# EAGLE design receiver_b (EAGLE 5.09)
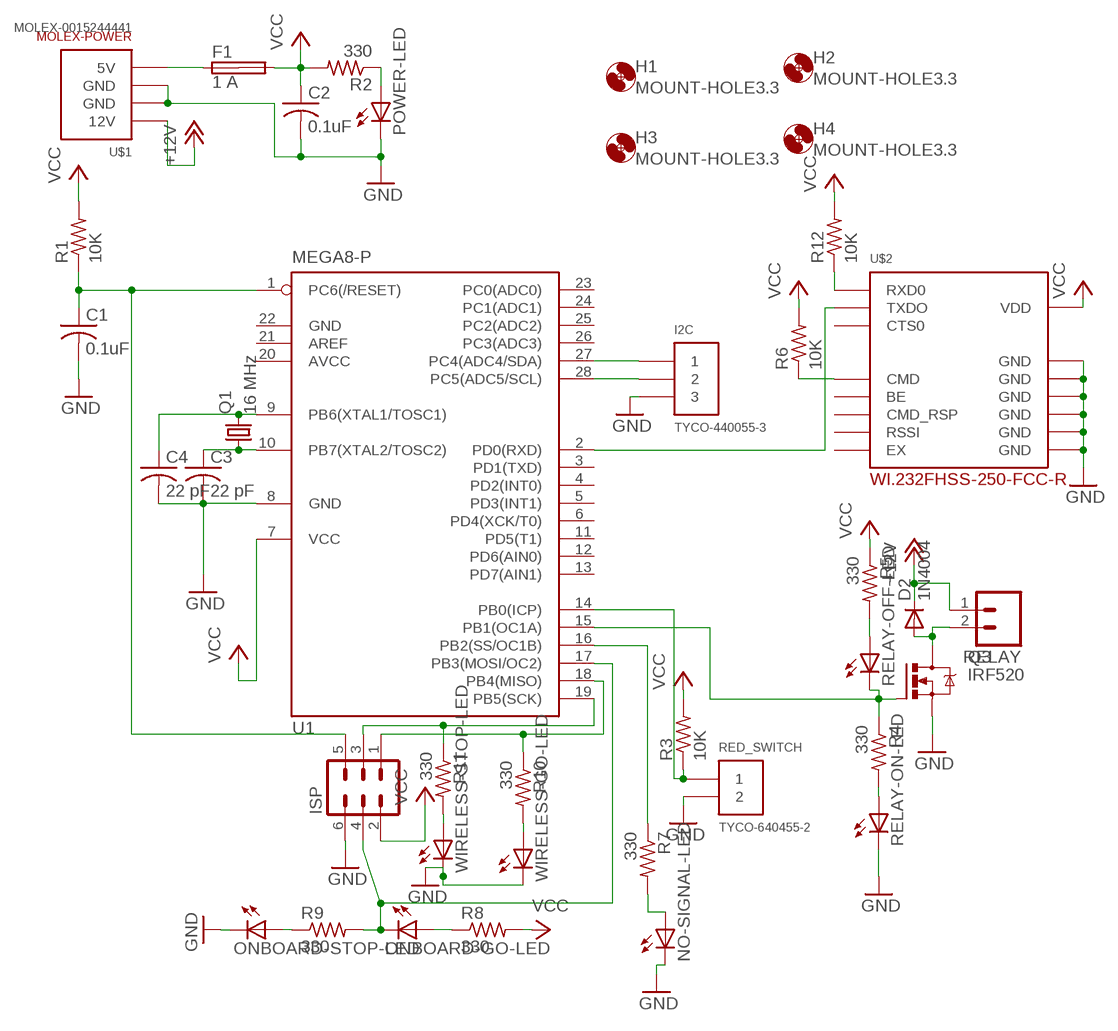
[diagram p0: schematic, sheet 1]

## Parts
C1  0.1uF  C-US050-055X075  [C050-055X075]
C2  0.1uF  C-US050-055X075  [C050-055X075]
C3  22 pF  C-US025-025X050  [C025-025X050]
C4  22 pF  C-US025-025X050  [C025-025X050]
D2  1N4004  [DO41-10]
F1  1 A  SHK20Q  [SHK20Q]
H1  MOUNT-HOLE3.3  [3,3]
H2  MOUNT-HOLE3.3  [3,3]
H3  MOUNT-HOLE3.3  [3,3]
H4  MOUNT-HOLE3.3  [3,3]
I2C  TYCO-440055-3  [HEADER-RA-2.00MM-3]
ISP  MA03-2  [MA03-2]
NO-SIGNAL-LED  LED3MM  [LED3MM]
ONBOARD-GO-LED  LED3MM  [LED3MM]
ONBOARD-STOP-LED  LED3MM  [LED3MM]
POWER-LED  LED5MM  [LED5MM]
Q1  16 MHz  CRYSTALHC49S  [HC49/S]
Q3  IRF520  [TO220BV]
R1  10K  R-US_0207/10  [0207/10]
R2  330  R-US_0207/10  [0207/10]
R3  10K  R-US_0207/10  [0207/10]
R4  330  R-US_0207/10  [0207/10]
R5  330  R-US_0207/10  [0207/10]
R6  10K  R-US_0207/10  [0207/10]
R7  330  R-US_0207/10  [0207/10]
R8  330  R-US_0207/10  [0207/10]
R9  330  R-US_0207/10  [0207/10]
R10  330  R-US_0207/10  [0207/10]
R11  330  R-US_0207/10  [0207/10]
R12  10K  R-US_0207/10  [0207/10]
RED_SWITCH  TYCO-640455-2  [HEADER-RA-POL-.100IN-2]
RELAY  M02POLAR  [MOLEX-1X2]
RELAY-OFF-LED  LED3MM  [LED3MM]
RELAY-ON-LED  LED3MM  [LED3MM]
U1  MEGA8-P  [DIL28-3]
U$1  MOLEX-0015244441  [MOLEX-0015244441B]
U$2  WI.232FHSS-250-FCC-R  [RADIOTRONIX-EVM]
WIRELESS-GO-LED  LED3MM  [LED3MM]
WIRELESS-STOP-LED  LED3MM  [LED3MM]

## Nets
+12V: D2.C RELAY.1 U$1.1(12V)
GND: C1.2 C2.2 C3.2 C4.2 I2C.3 ISP.6 NO-SIGNAL-LED.K(C) ONBOARD-STOP-LED.K(C) POWER-LED.K(C) Q3.S RED_SWITCH.2 RELAY-ON-LED.K(C) U1.8(GND) U$1.2(GND) U$1.3(GND) U$2.JP1-1(GND) U$2.JP1-2(GND) U$2.JP1-11(GND) U$2.JP1-12(GND) U$2.JP2-11(GND) U$2.JP2-12(GND) WIRELESS-GO-LED.K(C) WIRELESS-STOP-LED.K(C)
N$1: D2.A Q3.D RELAY.2
N$2: C3.1 Q1.1 U1.10(PB7(XTAL2/TOSC2))
N$3: C1.1 ISP.5 R1.1 U1.1(PC6(/RESET))
N$4: C4.1 Q1.2 U1.9(PB6(XTAL1/TOSC1))
N$6: F1.1A U$1.4(5V)
N$7: R3.1 RED_SWITCH.1 U1.14(PB0(ICP))
N$8: R5.2 RELAY-OFF-LED.A
N$9: Q3.G R4.1 RELAY-OFF-LED.K(C) U1.15(PB1(OC1A))
N$10: R4.2 RELAY-ON-LED.A
N$11: NO-SIGNAL-LED.A R7.2
N$12: R6.1 U$2.JP2-5(CMD)
N$13: I2C.1 U1.27(PC4(ADC4/SDA))
N$14: I2C.2 U1.28(PC5(ADC5/SCL))
N$15: U1.2(PD0(RXD)) U$2.JP2-3(TXDO)
N$16: R7.1 U1.16(PB2(SS/OC1B))
N$17: ONBOARD-STOP-LED.A R9.1
N$18: ONBOARD-GO-LED.A R8.1
N$19: R10.2 WIRELESS-GO-LED.A
N$20: R11.2 WIRELESS-STOP-LED.A
N$21: R12.1 U$2.JP2-2(RXD0)
N$22: ISP.1 R10.1 U1.18(PB4(MISO))
N$28: POWER-LED.A R2.1
N$31: ISP.3 R11.1 U1.19(PB5(SCK))
N$33: ISP.4 ONBOARD-GO-LED.K(C) R9.2 U1.17(PB3(MOSI/OC2))
VCC: C2.1 F1.2A ISP.2 R1.2 R2.2 R3.2 R5.1 R6.2 R8.2 R12.2 U1.7(VCC) U$2.JP2-1(VDD)
Unconnected: F1.1B F1.2B U1.3(PD1(TXD)) U1.4(PD2(INT0)) U1.5(PD3(INT1)) U1.6(PD4(XCK/T0)) U1.11(PD5(T1)) U1.12(PD6(AIN0)) U1.13(PD7(AIN1)) U1.21(AREF) U1.23(PC0(ADC0)) U1.24(PC1(ADC1)) U1.25(PC2(ADC2)) U1.26(PC3(ADC3)) U$2.JP1-3(BE) U$2.JP1-4(CMD_RSP) U$2.JP1-5(RSSI) U$2.JP1-6(EX) U$2.JP2-4(CTS0)

## Power pins joined to a net without a drawn wire
AVCC: U1.20(AVCC)
GND: U1.22(GND)

## Library data of the parts
C1-C4 = resistor:C-US: CAPACITOR, American symbol
D2 = diode:1N4004: DIODE general purpose rectifier, 1 A
F1 = fuse:SHK20Q: FUSE HOLDER 5 x 20 mm, SH contact, E1207 Buerklin 64G6061
H1-H4 = holes:MOUNT-HOLE: MOUNTING HOLE with drill center marker
I2C = chicagoedt:TYCO-440055-3: 3 pin right angle header with shroud and 2.00 mm pitch.
ISP = con-lstb:MA03-2: PIN HEADER
NO-SIGNAL-LED ONBOARD-GO-LED ONBOARD-STOP-LED POWER-LED RELAY-OFF-LED RELAY-ON-LED WIRELESS-GO-LED WIRELESS-STOP-LED = led:LED: LED OSRAM: - CHIPLED LG R971, LG N971, LY N971, LG Q971, LY Q971, LO R971, LY R971 LH N974, LH R974 LS Q976, LO Q976, LY Q976 LO Q996 - Hyper CHIPLED LW Q18S LB Q993, LB Q99A, LB R99A - SideLED LS A670, LO A670, LY A670, LG A670, LP A670 LB A673, LV A673, LT A673, LW A673 LH A674 LY A675 LS A676, LA A676, LO A676, LY A676, LW A676 LS A679, LY A679, LG A679 - Hyper Micro SIDELED® LS Y876, LA Y876, LO Y876, LY Y876 LT Y87S - SmartLED LW L88C, LW L88S LB L89C, LB L89S, LG L890 LS L89K, LO L89K, LY L89K LS L896, LA L896, LO L896, LY L896 - TOPLED LS T670, LO T670, LY T670, LG T670, LP T670 LSG T670, LSP T670, LSY T670, LOP T670, LYG T670 LG T671, LOG T671, LSG T671 LB T673, LV T673, LT T673, LW T673 LH T674 LS T676, LA T676, LO T676, LY T676, LB T676, LH T676, LSB T676, LW T676 LB T67C, LV T67C, LT T67C, LS T67K, LO T67K, LY T67K, LW E67C LS E67B, LA E67B, LO E67B, LY E67B, LB E67C, LV E67C, LT E67C LW T67C LS T679, LY T679, LG T679 LS T770, LO T770, LY T770, LG T770, LP T770 LB T773, LV T773, LT T773, LW T773 LH T774 LS E675, LA E675, LY E675, LS T675 LS T776, LA T776, LO T776, LY T776, LB T776 LHGB T686 LT T68C, LB T68C - Hyper Mini TOPLED® LB M676 - Mini TOPLED Santana® LG M470 LS M47K, LO M47K, LY M47K Source: http://www.osram.convergy.de LUXEON: - LUMILED® LXK2-PW12-R00, LXK2-PW12-S00, LXK2-PW14-U00, LXK2-PW14-V00 LXK2-PM12-R00, LXK2-PM12-S00, LXK2-PM14-U00 LXK2-PE12-Q00, LXK2-PE12-R00, LXK2-PE12-S00, LXK2-PE14-T00, LXK2-PE14-U00 LXK2-PB12-K00, LXK2-PB12-L00, LXK2-PB12-M00, LXK2-PB14-N00, LXK2-PB14-P00, LXK2-PB14-Q00 LXK2-PR12-L00, LXK2-PR12-M00, LXK2-PR14-Q00, LXK2-PR14-R00 LXK2-PD12-Q00, LXK2-PD12-R00, LXK2-PD12-S00 LXK2-PH12-R00, LXK2-PH12-S00 LXK2-PL12-P00, LXK2-PL12-Q00, LXK2-PL12-R00 Source: www.luxeon.com KINGBRIGHT: KA-3528ASYC Source: www.kingbright.com
Q1 = crystal:CRYSTAL: CRYSTAL
Q3 = transistor-power:IRF520: HEXFET Power MOSFET
R1-R12 = resistor:R-US_: RESISTOR, American symbol
RED_SWITCH = chicagoedt:TYCO-640455-2: 2 pin right angle header with polarizing tab and .100" pitch.
RELAY = SparkFun:M02: Header 2 Standard 2-pin 0.1" header. Use with straight break away headers (SKU : PRT-00116), right angle break away headers (PRT-00553), swiss pins (PRT-00743), machine pins (PRT-00117), and female headers (PRT-00115). Molex polarized connector foot print use with SKU : PRT-08233 with associated crimp pins and housings.
U1 = atmel:MEGA8-P: MICROCONTROLLER 8 Kbytes FLASH, 1 kbytes SRAM, 512 bytes EEPROM, USART, 4-channel 10 bit ADC, 2-channel 8 bit ADC Pin compatible with Atmega48, ATMega88, ATMega168 Source: avr.lbr
U$1 = chicagoedt:MOLEX-0015244441: 5.08mm (.200") Pitch Disk Drive Power Connection System Header, Right Angle, Through Hole, 4 Circuits, Lead-free, 3.56mm (.140") PC Tail Length, with PCB Locator Peg
U$2 = chicagoedt:WI.232FHSS-250-FCC-R: 902 - 928 MHz FCC approved Wi.232FHSS-250-R modules with reverse SMA connector

## Board
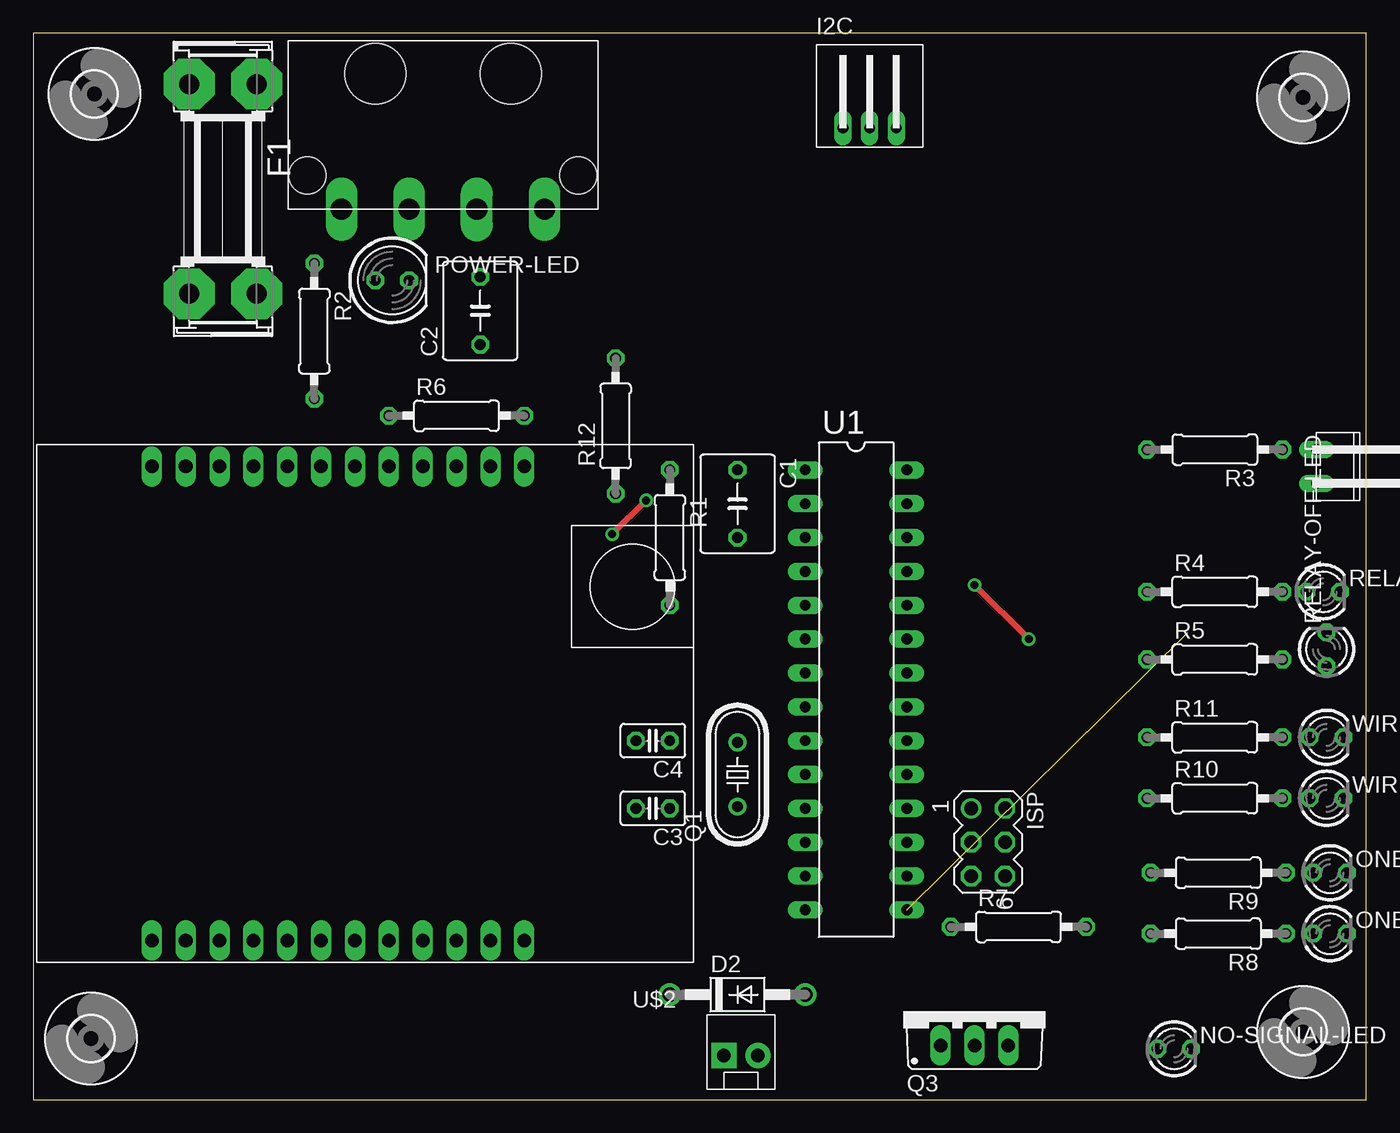
[diagram p1: board, top side]
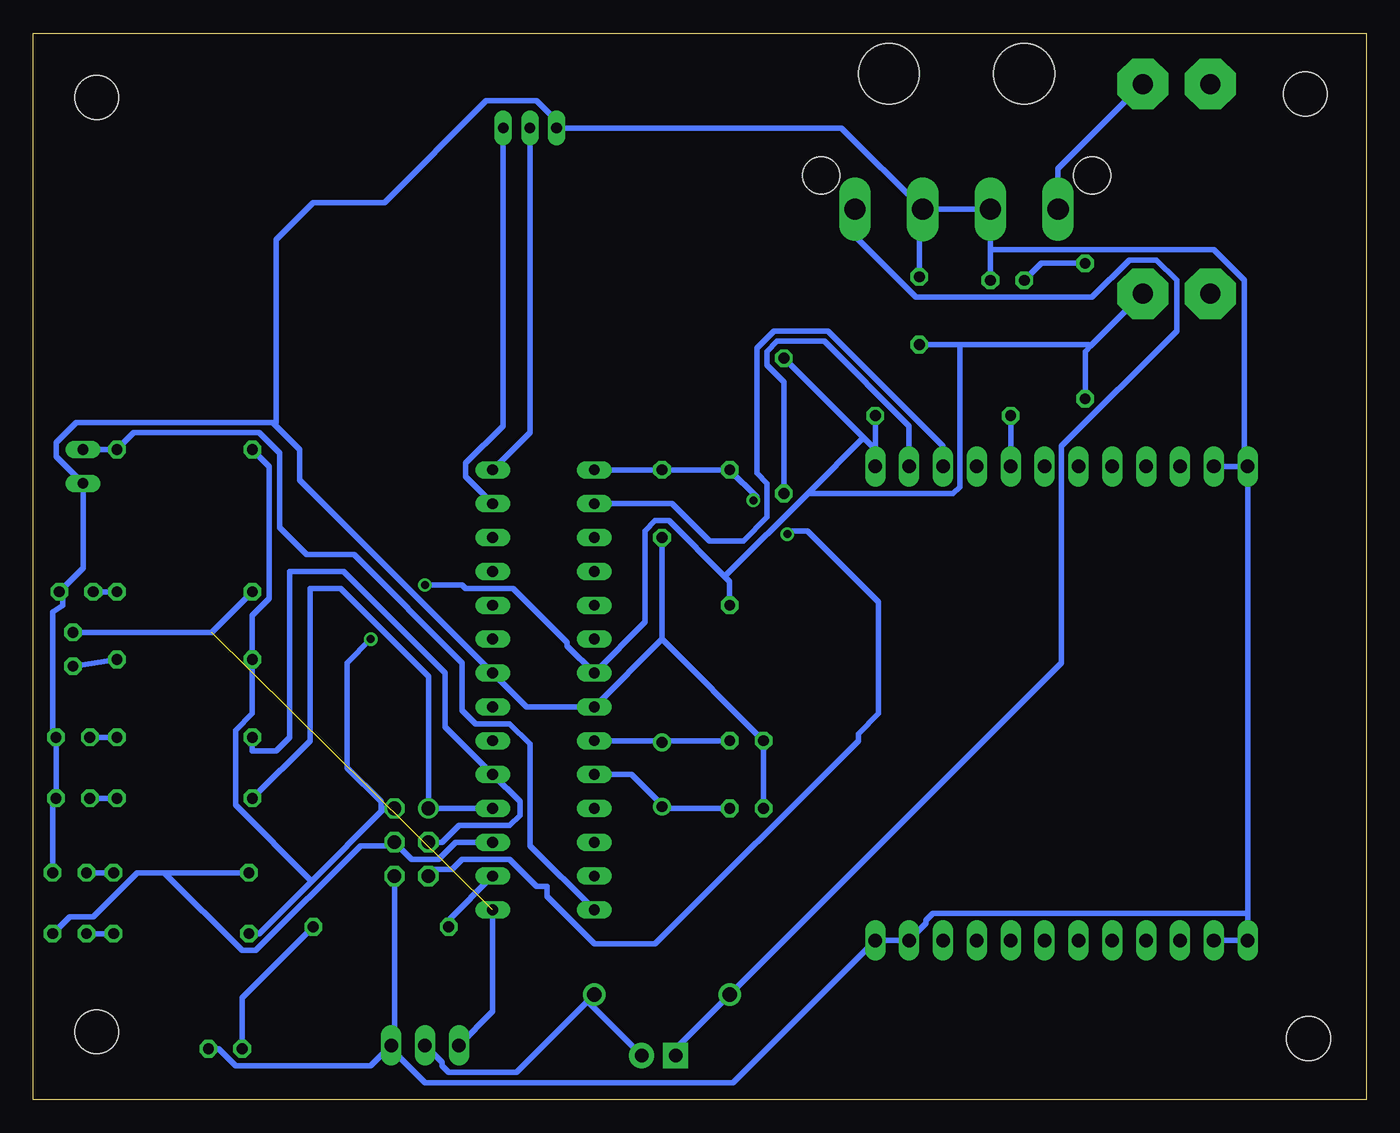
[diagram p2: board, bottom side, seen from below]

Size 100 x 80 mm. Coordinates in mm from the lower left corner, seen from the top.
Outline: 0,0 100,0 100,80 0,80 0,0
Copper layers (1*16): Top 0.035mm / dielectric 1.5mm / Bottom 0.035mm
Design rules "default *": minimum track width 16mil, minimum drill 24mil, track to track 12mil, track to pad 12mil, pad to pad 8mil, via to via 8mil, smd to smd 8mil, copper to edge 40mil, drill to drill 8mil, minimum pad ring 10mil, minimum via ring 8mil, stop-mask expansion 4mil, vias tented up to drill 0mil, thermal gap 10mil

### Footprints (pad centres in the part's own frame; a part is rotated, then mirrored left to right if it is on the bottom)
C050-055X075 = drill 0.813 octagon: 1 -2.54,0; 2 2.54,0
C025-025X050 = drill 0.813 octagon: 1 -1.27,0; 2 1.27,0
DO41-10 = drill 1.118 round: A 5.08,0; C -5.08,0
SHK20Q = drill 1.5 pad 3.81 octagon: 1A -7.874,2.54; 1B -7.874,-2.54; 2A 7.874,2.54; 2B 7.874,-2.54
3,3 = hole 3.3: 0,0
HEADER-RA-2.00MM-3 = drill 0.8 long: 1 2,0; 2 0,0; 3 -2,0
MA03-2 = drill 1.016 round: 1 -2.54,-1.27 | drill 1.016 octagon: 2 -2.54,1.27; 3 0,-1.27; 4 0,1.27; 5 2.54,-1.27; 6 2.54,1.27
LED3MM = drill 0.813 octagon: A -1.27,0; K 1.27,0
LED5MM = drill 0.813 octagon: A -1.27,0; K 1.27,0
HC49/S = drill 0.813 round: 1 -2.413,0; 2 2.413,0
TO220BV = drill 1.016 long: D 0,-2.54; G -2.54,-2.54; S 2.54,-2.54
0207/10 = drill 0.813 octagon: 1 -5.08,0; 2 5.08,0
HEADER-RA-POL-.100IN-2 = drill 0.8 long: 1 -1.27,-5.08; 2 1.27,-5.08
MOLEX-1X2 = drill 1.016 pad 1.88 square: 1 0,0 | drill 1.016 pad 1.88 round: 2 2.54,0
DIL28-3 = drill 0.813 long: 1 -16.51,-3.81; 2 -13.97,-3.81; 3 -11.43,-3.81; 4 -8.89,-3.81; 5 -6.35,-3.81; 6 -3.81,-3.81; 7 -1.27,-3.81; 8 1.27,-3.81; 9 3.81,-3.81; 10 6.35,-3.81; 11 8.89,-3.81; 12 11.43,-3.81; 13 13.97,-3.81; 14 16.51,-3.81; 15 16.51,3.81; 16 13.97,3.81; 17 11.43,3.81; 18 8.89,3.81; 19 6.35,3.81; 20 3.81,3.81; 21 1.27,3.81; 22 -1.27,3.81; 23 -3.81,3.81; 24 -6.35,3.81; 25 -8.89,3.81; 26 -11.43,3.81; 27 -13.97,3.81; 28 -16.51,3.81
MOLEX-0015244441B = drill 1.587 pad 1.778 long: 1 7.62,-6.35; 3 -2.54,-6.35; 4 -7.62,-6.35 | drill 1.6 pad 1.651 long: 2 2.54,-6.35 | hole 2.794: -10.16,-3.81; 10.16,-3.81 | hole 4.572: -5.08,3.81; 5.08,3.81
RADIOTRONIX-EVM = drill 1.016 long: JP1-1 -13.97,17.78; JP1-2 -11.43,17.78; JP1-3 -8.89,17.78; JP1-4 -6.35,17.78; JP1-5 -3.81,17.78; JP1-6 -1.27,17.78; JP1-7 1.27,17.78; JP1-8 3.81,17.78; JP1-9 6.35,17.78; JP1-10 8.89,17.78; JP1-11 11.43,17.78; JP1-12 13.97,17.78; JP2-1 -13.97,-17.78; JP2-2 -11.43,-17.78; JP2-3 -8.89,-17.78; JP2-4 -6.35,-17.78; JP2-5 -3.81,-17.78; JP2-6 -1.27,-17.78; JP2-7 1.27,-17.78; JP2-8 3.81,-17.78; JP2-9 6.35,-17.78; JP2-10 8.89,-17.78; JP2-11 11.43,-17.78; JP2-12 13.97,-17.78

### Placement (x,y rotation side)
C1  52.83,44.7 270 top
C2  33.53,59.18 90 top
C3  46.48,21.84 180 top
C4  46.48,26.92 180 top
D2  52.83,7.87 0 top
F1  14.22,68.33 270 top
H1  4.57,75.44 0 top
H2  95.25,75.18 0 top
H3  95.25,5.08 0 top
H4  4.32,4.57 0 top
I2C  62.74,72.9 0 top
ISP  71.63,19.3 270 top
NO-SIGNAL-LED  85.6,3.81 0 top
ONBOARD-GO-LED  97.28,12.45 0 top
ONBOARD-STOP-LED  97.28,17.02 0 top
POWER-LED  26.92,61.47 0 top
Q1  52.83,24.38 90 top
Q3  70.61,6.6 0 top
R1  47.75,42.16 270 top
R2  21.08,57.66 270 top
R3  88.65,48.77 180 top
R4  88.65,38.1 0 top
R5  88.65,33.02 0 top
R6  31.75,51.31 0 top
R7  73.91,12.95 0 top
R8  88.9,12.45 180 top
R9  88.9,17.02 180 top
R10  88.65,22.61 0 top
R11  88.65,27.18 0 top
R12  43.69,50.55 90 top
RED_SWITCH  101.35,47.5 270 top
RELAY  51.82,3.3 0 top
RELAY-OFF-LED  97.03,33.78 90 top
RELAY-ON-LED  96.77,38.1 0 top
U1  61.72,30.73 270 top
U$1  30.73,73.15 0 top
U$2  22.86,29.72 180 top
WIRELESS-GO-LED  97.03,22.61 0 top
WIRELESS-STOP-LED  97.03,27.18 0 top

### Tracks (layer width: path | path; a pad name or v marks a point on that pad's centre or on a via)
+12V
  Bottom 0.406: U$1.1 38.35,64.77 33.78,60.2 20.57,60.2 17.78,62.99 15.75,62.99 14.22,61.47 14.22,57.66 22.86,49.02 22.86,32.77 D2.C 51.82,3.81 RELAY.1
GND
  Bottom 0.406: ONBOARD-STOP-LED.K 98.55,22.35 WIRELESS-GO-LED.K WIRELESS-STOP-LED.K 98.55,27.43 98.55,36.58 97.79,37.08 97.79,38.1 RELAY-ON-LED.K 96.27,39.88 RED_SWITCH.2 98.3,48.26 98.3,49.28 96.77,50.8 82.04,50.8 81.92,50.67 | C3.2 C4.2 52.83,34.54 | 52.83,34.54 C1.2 | 52.83,34.54 U1.8 62.99,29.46 U1.22 80.01,46.48 80.01,48.77 81.92,50.67 | U$1.2 U$1.3 28.19,63.75 | U$1.2 39.37,72.9 I2C.3 60.96,72.9 60.96,73.66 62.23,74.93 66.04,74.93 73.66,67.31 78.99,67.31 81.79,64.52 81.79,50.8 81.92,50.67 | 28.19,63.75 POWER-LED.K | C2.2 33.53,66.8 U$1.2 | NO-SIGNAL-LED.K 86.11,3.81 84.84,2.54 74.68,2.54 Q3.S | ISP.6 72.9,4.32 Q3.S | U$2.JP1-11 U$2.JP1-12 8.89,13.97 | 9.14,47.5 U$2.JP2-11 | 8.89,13.97 U$2.JP2-12 9.14,47.5 | 8.89,13.97 32.51,13.97 33.02,13.46 33.02,13.21 U$2.JP1-2 U$2.JP1-1 47.5,1.27 70.61,1.27 73.15,3.81 Q3.S | 28.19,63.75 11.43,63.75 9.14,61.47 9.14,47.5
N$1
  Bottom 0.406: Q3.D 69.34,2.79 69.34,2.54 68.83,2.03 63.75,2.03 58.42,7.37 | RELAY.2 58.42,7.37 | 58.42,7.37 D2.A
N$2
  Bottom 0.406: C3.1 52.83,21.84 Q1.1 52.83,22.1 55.12,24.38 U1.10
N$3  (via drill 0.6)
  Top 0.406: v43.43,42.42 v45.97,44.96
  Bottom 0.406: U1.1 C1.1 R1.1 45.72,45.21 v45.97,44.96 | ISP.5 69.85,17.27 68.58,17.27 67.82,18.03 64.26,18.03 62.23,16 61.47,16 61.47,15.24 57.91,11.68 53.34,11.68 38.1,26.92 38.1,27.43 36.58,28.96 36.58,37.34 41.91,42.67 43.43,42.67 v43.43,42.42
N$4
  Bottom 0.406: C4.1 52.83,26.92 | 52.83,26.92 U1.9 | 52.83,26.92 Q1.2
N$6
  Bottom 0.406: U$1.4 23.11,69.85 F1.1A
N$7
  Bottom 0.406: RED_SWITCH.1 R3.1 92.46,50.04 83.06,50.04 81.53,48.51 81.53,42.93 79.5,40.89 75.95,40.89 67.82,32.77 67.82,29.21 66.8,28.19 64.26,28.19 62.74,26.67 62.74,19.05 U1.14
N$8
  Bottom 0.406: R5.2 RELAY-OFF-LED.A
N$9  (1 unrouted)
  Bottom 0.406: RELAY-OFF-LED.K 86.61,35.05 R4.1 | U1.15 65.53,6.6 Q3.G
N$10
  Bottom 0.406: R4.2 RELAY-ON-LED.A
N$11
  Bottom 0.406: NO-SIGNAL-LED.A 84.33,7.62 R7.2
N$12
  Bottom 0.406: U$2.JP2-5 R6.1
N$13
  Bottom 0.406: U1.27 67.56,46.74 67.56,47.75 64.77,50.55 64.77,72.9 I2C.1
N$14
  Bottom 0.406: I2C.2 62.74,50.04 U1.28
N$15
  Bottom 0.406: U1.2 52.07,44.7 49.28,41.91 46.74,41.91 44.96,43.69 44.96,46.23 45.72,46.99 45.72,52.07 45.72,56.39 44.45,57.66 40.39,57.66 31.75,49.02 U$2.JP2-3
N$16
  Bottom 0.406: U1.16 68.83,13.46 R7.1
N$17
  Bottom 0.406: ONBOARD-STOP-LED.A R9.1
N$18
  Bottom 0.406: ONBOARD-GO-LED.A R8.1
N$19
  Bottom 0.406: R10.2 WIRELESS-GO-LED.A
N$20
  Bottom 0.406: R11.2 WIRELESS-STOP-LED.A
N$21
  Bottom 0.406: R12.1 43.69,53.85 44.96,55.12 44.96,56.13 44.2,56.9 40.64,56.9 34.29,50.55 U$2.JP2-2
N$22
  Bottom 0.406: U1.18 ISP.1 70.36,31.75 76.96,38.35 79.25,38.35 79.25,26.92 R10.1
N$28
  Bottom 0.406: R2.1 24.38,62.74 POWER-LED.A
N$31
  Bottom 0.406: R11.1 83.57,26.16 81.79,26.16 80.77,27.18 80.77,39.62 76.71,39.62 69.09,32 69.09,27.94 U1.19 63.5,22.35 63.5,21.34 64.26,20.57 68.07,20.57 69.34,19.3 ISP.3
N$33
  Bottom 0.406: U1.17 68.33,19.3 69.6,18.03 71.63,18.03 ISP.4 72.9,19.05 75.44,19.05 83.31,11.18 84.33,11.18 90.17,17.02 | 90.17,17.02 92.2,17.02 95.5,13.72 97.28,13.72 ONBOARD-GO-LED.K | 90.17,17.02 R9.2
VCC  (via drill 0.6)
  Top 0.406: v70.61,38.61 v74.68,34.54
  Bottom 0.406: R2.2 21.08,56.13 20.7,56.52 | 20.7,56.52 F1.2A | 30.48,56.64 20.83,56.64 20.7,56.52 | 30.48,56.64 C2.1 | 36.83,48.77 R6.2 | 37.72,49.66 36.83,48.77 | 37.72,49.66 R12.2 | 36.83,48.77 U$2.JP2-1 | 48.13,39.24 47.75,38.86 R1.2 | 48.13,39.24 52.32,43.43 53.34,43.43 54.1,42.67 54.1,35.81 U1.7 59.94,34.04 59.94,34.29 64.01,38.35 67.56,38.35 67.82,38.61 v70.61,38.61 | 41.78,45.59 37.72,49.66 | 41.78,45.59 48.13,39.24 | 30.48,56.64 30.48,45.97 30.99,45.47 41.66,45.47 41.78,45.59 | R3.2 82.3,47.5 82.3,37.59 83.57,36.32 R5.1 83.57,28.96 84.84,27.69 84.84,22.1 79.12,16.38 | R8.2 83.06,12.45 79.12,16.38 | 73.79,21.72 73.66,21.84 ISP.2 | 73.79,21.72 79.12,16.38 | v74.68,34.54 76.45,32.77 76.45,24.89 73.91,22.35 73.91,21.84 73.79,21.72